# EAGLE design shock_side_control (EAGLE 9.0.1)
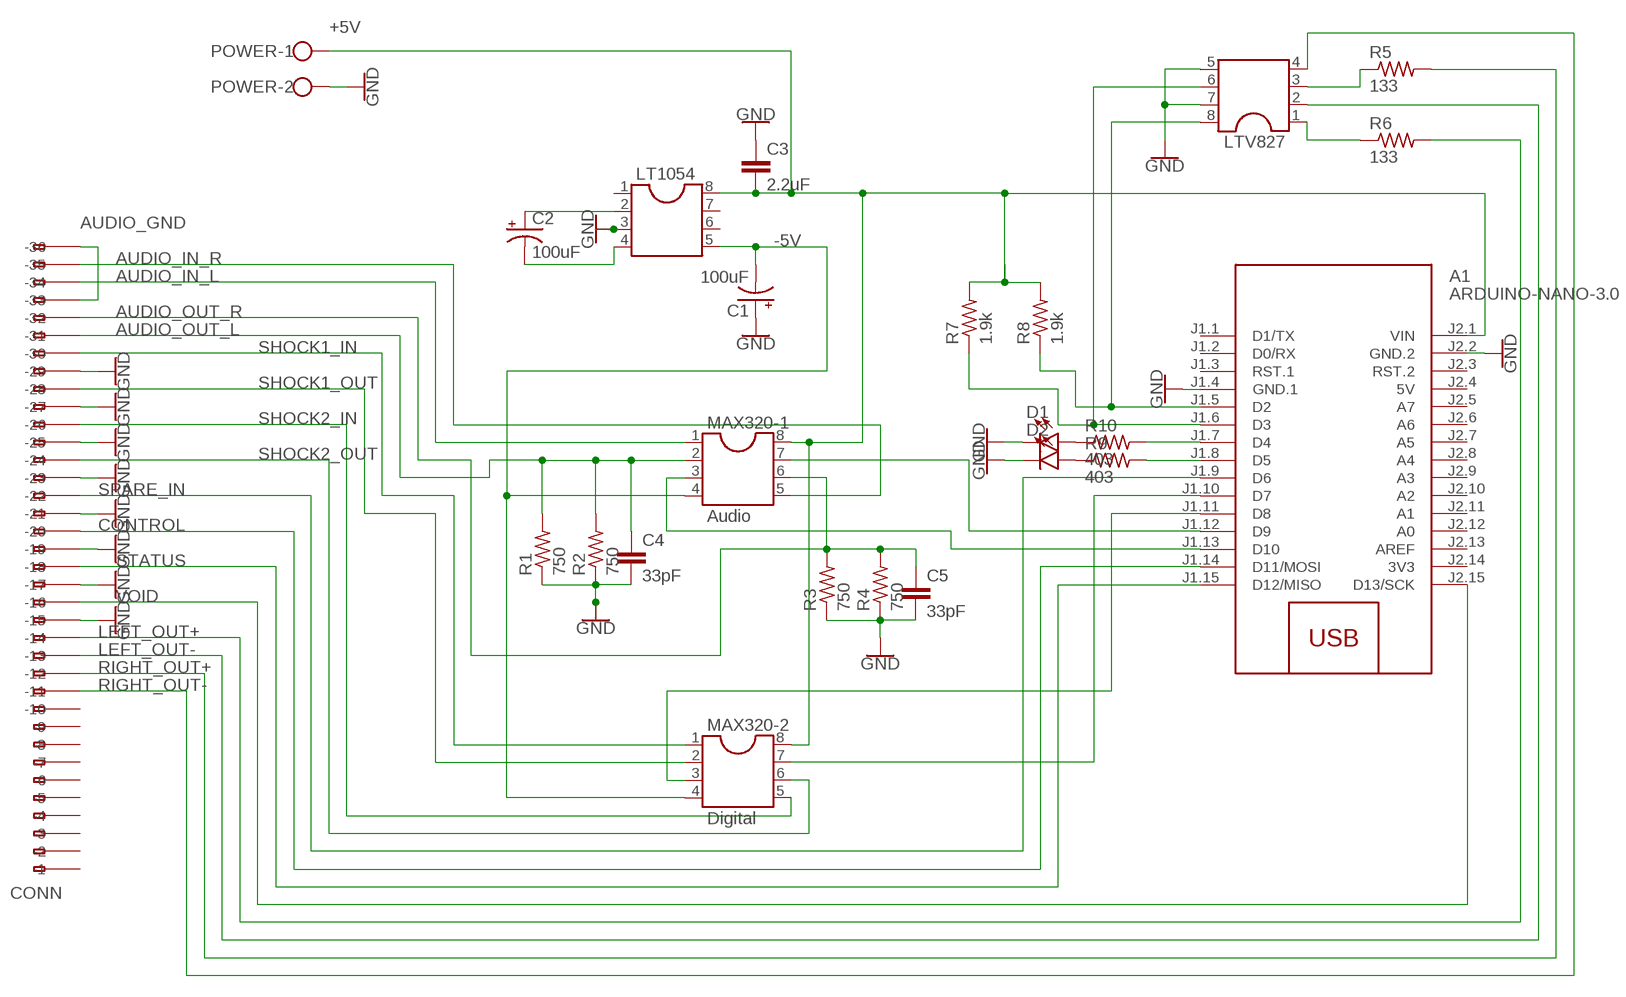
[diagram p0: schematic, sheet 1]

## Parts
A1  ARDUINO-NANO-3.0  [ARDUINO-NANO-3.0]
C1  100uF  100UF-POLAR-RADIAL-2.5MM-25V-20%  [CPOL-RADIAL-2.5MM-6.5MM]
C2  100uF  100UF-POLAR-RADIAL-2.5MM-25V-20%  [CPOL-RADIAL-2.5MM-6.5MM]
C3  2.2uF  C5/2.5  [C5B2.5]
C4  33pF  C5/2.5  [C5B2.5]
C5  33pF  C5/2.5  [C5B2.5]
CONN  233-136  [233-136]
D1  LED-3MM-NO_SILK  [LED_3MM-NS]
D2  LED-3MM-NO_SILK  [LED_3MM-NS]
LT1054  DIL8  [DIL08]
LTV827  DIL8  [DIL08]
MAX320-1  Audio  DIL8  [DIL08]
MAX320-2  Digital  DIL8  [DIL08]
POWER  W237-02P  [W237-132]
R1  750  FLIPFLOP-RES  [0805-THM]
R2  750  FLIPFLOP-RES  [0805-THM]
R3  750  FLIPFLOP-RES  [0805-THM]
R4  750  FLIPFLOP-RES  [0805-THM]
R5  133  FLIPFLOP-RES  [0805-THM]
R6  133  FLIPFLOP-RES  [0805-THM]
R7  1.9k  FLIPFLOP-RES  [0805-THM]
R8  1.9k  FLIPFLOP-RES  [0805-THM]
R9  403  FLIPFLOP-RES  [0805-THM]
R10  403  FLIPFLOP-RES  [0805-THM]

## Nets
+5V: A1.J2.1(VIN) C3.2 LT1054.8 MAX320-1.8 MAX320-2.8 POWER.1 R7.2 R8.2
-5V: C1.2(-) LT1054.5 MAX320-1.4 MAX320-2.4
AUDIO_GND: CONN.A33(-33) CONN.A36(-36)
AUDIO_IN_L: CONN.A34(-34) MAX320-1.1
AUDIO_IN_R: CONN.A35(-35) MAX320-1.5
AUDIO_OUT_L: C4.1 CONN.A31(-31) MAX320-1.2 R1.2 R2.2
AUDIO_OUT_R: C5.1 CONN.A32(-32) MAX320-1.6 R3.2 R4.2
CONTROL: A1.J1.14(D11/MOSI) CONN.A20(-20)
GND: A1.J1.4(GND.1) A1.J2.2(GND.2) C1.1(+) C3.1 C4.2 C5.2 CONN.A15(-15) CONN.A17(-17) CONN.A19(-19) CONN.A21(-21) CONN.A23(-23) CONN.A25(-25) CONN.A27(-27) CONN.A29(-29) D1.K(C) D2.K(C) LT1054.3 LTV827.5 LTV827.7 POWER.2 R1.1 R2.1 R3.1 R4.1
LEFT_OUT+: CONN.A14(-14) R6.2
LEFT_OUT-: CONN.A13(-13) LTV827.2
N$1: A1.J1.12(D9) MAX320-1.7
N$2: C2.2(-) LT1054.4
N$3: C2.1(+) LT1054.2
N$4: A1.J1.13(D10) MAX320-1.3
N$5: D2.A R9.1
N$6: D1.A R10.1
N$8: A1.J1.8(D5) R9.2
N$10: A1.J1.7(D4) R10.2
N$11: A1.J1.10(D7) MAX320-2.7
N$12: A1.J1.11(D8) MAX320-2.3
N$21: LTV827.1 R6.1
N$22: LTV827.3 R5.1
N$25: A1.J1.5(D2) LTV827.8 R8.1
N$26: A1.J1.6(D3) LTV827.6 R7.1
RIGHT_OUT+: CONN.A12(-12) R5.2
RIGHT_OUT-: CONN.A11(-11) LTV827.4
SHOCK1_IN: CONN.A30(-30) MAX320-2.1
SHOCK1_OUT: CONN.A28(-28) MAX320-2.2
SHOCK2_IN: CONN.A26(-26) MAX320-2.5
SHOCK2_OUT: CONN.A24(-24) MAX320-2.6
SPARE_IN: A1.J1.9(D6) CONN.A22(-22)
STATUS: A1.J1.15(D12/MISO) CONN.A18(-18)
VOID: A1.J2.15(D13/SCK) CONN.A16(-16)
Unconnected: A1.J1.1(D1/TX) A1.J1.2(D0/RX) A1.J1.3(RST.1) A1.J2.3(RST.2) A1.J2.5(A7) A1.J2.6(A6) A1.J2.7(A5) A1.J2.8(A4) A1.J2.9(A3) A1.J2.10(A2) A1.J2.11(A1) A1.J2.12(A0) A1.J2.13(AREF) CONN.A1(-1) CONN.A2(-2) CONN.A3(-3) CONN.A4(-4) CONN.A5(-5) CONN.A6(-6) CONN.A7(-7) CONN.A8(-8) CONN.A9(-9) CONN.A10(-10) CONN.B1(B-1) CONN.B2(B-2) CONN.B3(B-3) CONN.B4(B-4) CONN.B5(B-5) CONN.B6(B-6) CONN.B7(B-7) CONN.B8(B-8) CONN.B9(B-9) CONN.B10(B-10) CONN.B11(B-11) CONN.B12(B-12) CONN.B13(B-13) CONN.B14(B-14) CONN.B15(B-15) CONN.B16(B-16) CONN.B17(B-17) CONN.B18(B-18) CONN.B19(B-19) CONN.B20(B-20) CONN.B21(B-21) CONN.B22(B-22) CONN.B23(B-23) CONN.B24(B-24) CONN.B25(B-25) CONN.B26(B-26) CONN.B27(B-27) CONN.B28(B-28) CONN.B29(B-29) CONN.B30(B-30) CONN.B31(B-31) CONN.B32(B-32) CONN.B33(B-33) CONN.B34(B-34) CONN.B35(B-35) CONN.B36(B-36) LT1054.1 LT1054.6 LT1054.7

## Power pins joined to a net without a drawn wire
3V3: A1.J2.14(3V3)
5V: A1.J2.4(5V)

## Library data of the parts
A1 = diy-modules:ARDUINO-NANO-3.0: Arduino Nano 3.0 and compatible devices More details available here: https://www.arduino.cc/en/Main/ArduinoBoardNano Click here to find device on ebay.com <http://www.ebay.com/sch/arduino+nano>
C1 C2 = SparkFun-Capacitors:100UF-POLAR: 100µF polarized capacitors A capacitor is a passive two-terminal electrical component used to store electrical energy temporarily in an electric field.; PROD_ID: CAP-08439
C3-C5 = capacitor-wima:C: CAPACITOR naming: grid - package width
CONN = con-wago255:233-136: WAGO
D1 D2 = SparkFun-LED:LED: LED (Generic) Standard schematic elements and footprints for 5mm, 3mm, 1206, and 0603 sized LEDs. Generic LEDs with no color specified.
LT1054 LTV827 MAX320-1 MAX320-2 = ic-package:DIL8: Dual In Line / Socket
POWER = con-wago-508:W237-02P: WAGO SREW CLAMP
R1-R10 = adafruit:FLIPFLOP-RES: Flip Flop resistor An 0805 resistor inside a standard 1/4W 5% resistor. Makes for easy mods

## Board
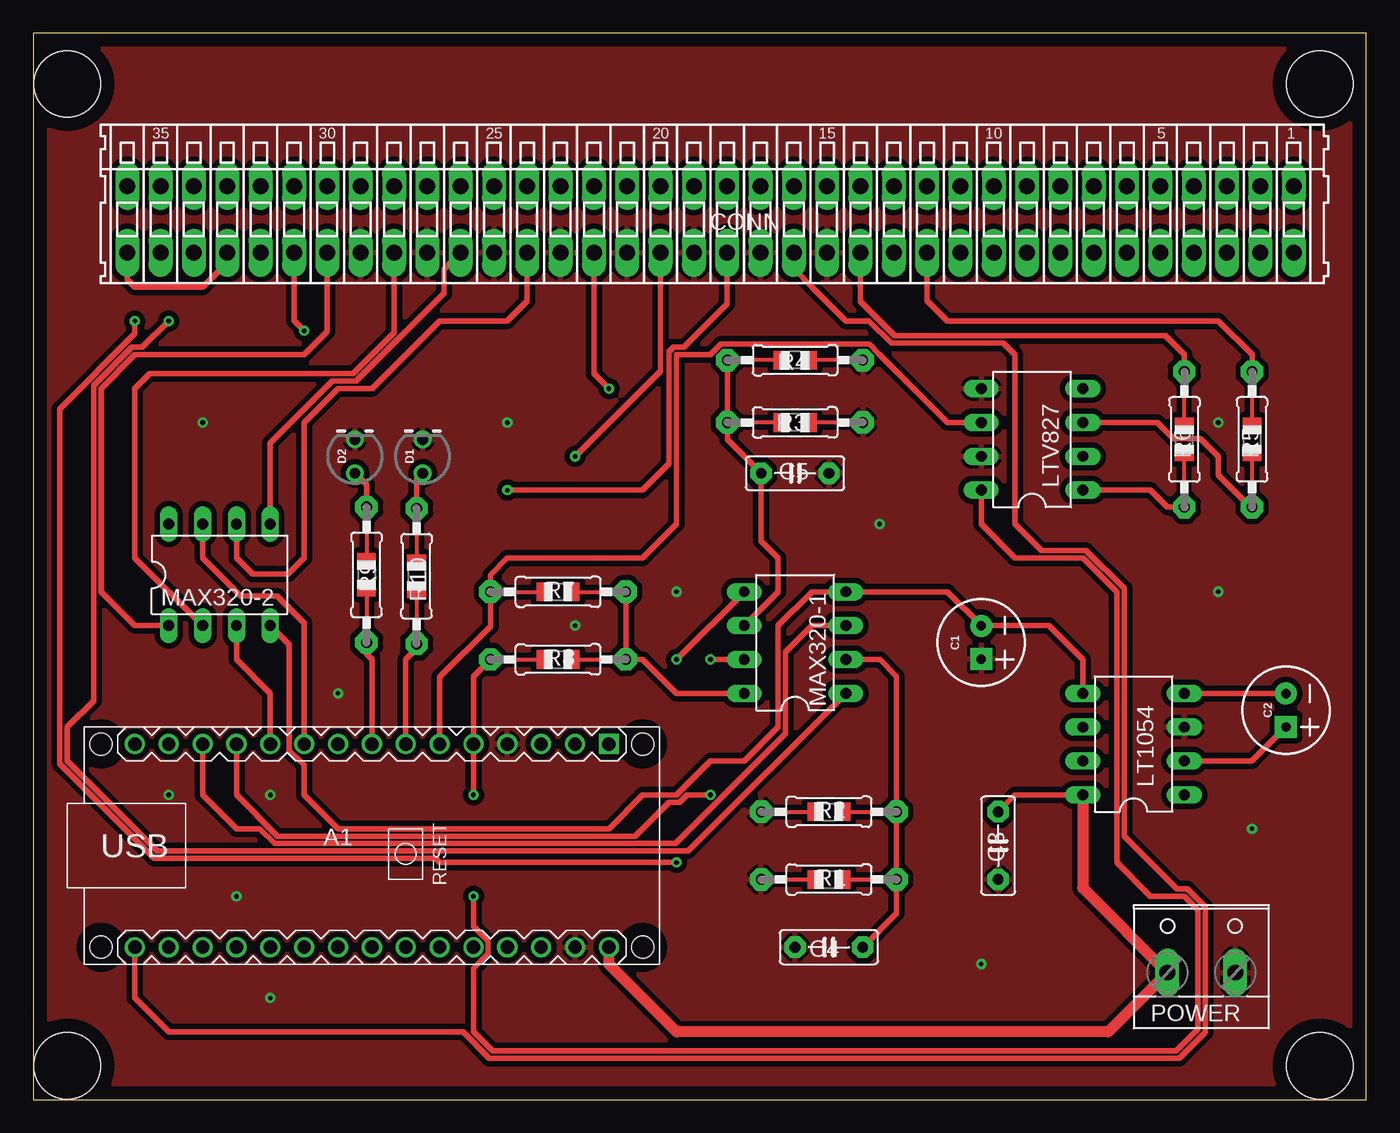
[diagram p1: board, top side]
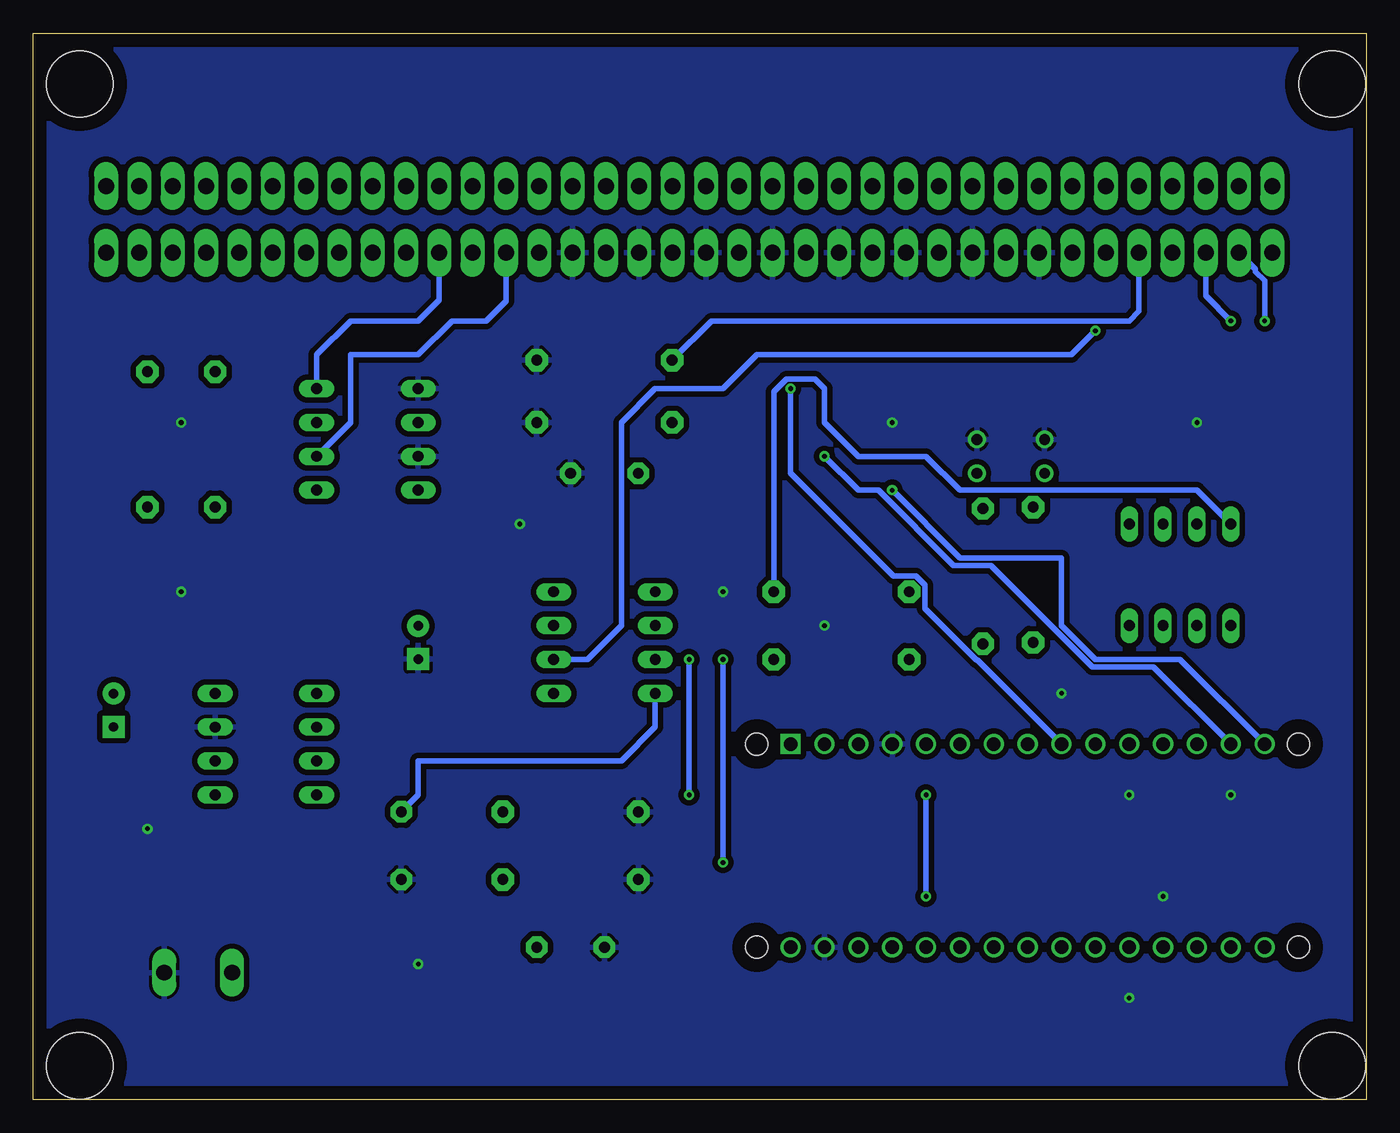
[diagram p2: board, bottom side, seen from below]

Size 100 x 80 mm. Coordinates in mm from the lower left corner, seen from the top.
Outline: 0,0 100,0 100,80 0,80 0,0
Copper layers (1*16): Top 0.035mm / dielectric 1.5mm / Bottom 0.035mm
Design rules "default": minimum track width 6mil, minimum drill 0.35mm, track to track 6mil, track to pad 6mil, pad to pad 6mil, via to via 6mil, smd to smd 6mil, copper to edge 40mil, drill to drill 6mil, minimum pad ring 10mil, minimum via ring 8mil, stop-mask expansion 4mil, vias tented up to drill 0mil, thermal gap 10mil
Holes 5 mm at 2.54,76.2 96.52,76.2 96.52,2.54 2.54,2.54

### Footprints (pad centres in the part's own frame; a part is rotated, then mirrored left to right if it is on the bottom)
ARDUINO-NANO-3.0 = drill 1 square: J1.1 17.78,7.62 | drill 1: J1.2 15.24,7.62; J1.3 12.7,7.62; J1.4 10.16,7.62; J1.5 7.62,7.62; J1.6 5.08,7.62; J1.7 2.54,7.62; J1.8 0,7.62; J1.9 -2.54,7.62; J1.10 -5.08,7.62; J1.11 -7.62,7.62; J1.12 -10.16,7.62; J1.13 -12.7,7.62; J1.14 -15.24,7.62; J1.15 -17.78,7.62; J2.1 17.78,-7.62; J2.2 15.24,-7.62; J2.3 12.7,-7.62; J2.4 10.16,-7.62; J2.5 7.62,-7.62; J2.6 5.08,-7.62; J2.7 2.54,-7.62; J2.8 0,-7.62; J2.9 -2.54,-7.62; J2.10 -5.08,-7.62; J2.11 -7.62,-7.62; J2.12 -10.16,-7.62; J2.13 -12.7,-7.62; J2.14 -15.24,-7.62; J2.15 -17.78,-7.62 | hole 1.651: -20.32,7.62; -20.32,-7.62; 20.32,-7.62; 20.32,7.62
CPOL-RADIAL-2.5MM-6.5MM = drill 0.7 pad 1.651 square: 1 1.25,0 | drill 0.7 pad 1.651: 2 -1.25,0
C5B2.5 = drill 0.813 pad 1.6 octagon: 1 -2.54,0; 2 2.54,0
233-136 = drill 1.2 long: A1 -43.75,2.5; A2 -41.25,2.5; A3 -38.75,2.5; A4 -36.25,2.5; A5 -33.75,2.5; A6 -31.25,2.5; A7 -28.75,2.5; A8 -26.25,2.5; A9 -23.75,2.5; A10 -21.25,2.5; A11 -18.75,2.5; A12 -16.25,2.5; A13 -13.75,2.5; A14 -11.25,2.5; A15 -8.75,2.5; A16 -6.25,2.5; A17 -3.75,2.5; A18 -1.25,2.5; A19 1.25,2.5; A20 3.75,2.5; A21 6.25,2.5; A22 8.75,2.5; A23 11.25,2.5; A24 13.75,2.5; A25 16.25,2.5; A26 18.75,2.5; A27 21.25,2.5; A28 23.75,2.5; A29 26.25,2.5; A30 28.75,2.5; A31 31.25,2.5; A32 33.75,2.5; A33 36.25,2.5; A34 38.75,2.5; A35 41.25,2.5; A36 43.75,2.5; B1 -43.75,-2.5; B2 -41.25,-2.5; B3 -38.75,-2.5; B4 -36.25,-2.5; B5 -33.75,-2.5; B6 -31.25,-2.5; B7 -28.75,-2.5; B8 -26.25,-2.5; B9 -23.75,-2.5; B10 -21.25,-2.5; B11 -18.75,-2.5; B12 -16.25,-2.5; B13 -13.75,-2.5; B14 -11.25,-2.5; B15 -8.75,-2.5; B16 -6.25,-2.5; B17 -3.75,-2.5; B18 -1.25,-2.5; B19 1.25,-2.5; B20 3.75,-2.5; B21 6.25,-2.5; B22 8.75,-2.5; B23 11.25,-2.5; B24 13.75,-2.5; B25 16.25,-2.5; B26 18.75,-2.5; B27 21.25,-2.5; B28 23.75,-2.5; B29 26.25,-2.5; B30 28.75,-2.5; B31 31.25,-2.5; B32 33.75,-2.5; B33 36.25,-2.5; B34 38.75,-2.5; B35 41.25,-2.5; B36 43.75,-2.5
LED_3MM-NS = drill 0.813: A -1.27,0; K 1.27,0
DIL08 = drill 0.813 long: 1 -3.81,-3.81; 2 -1.27,-3.81; 3 1.27,-3.81; 4 3.81,-3.81; 5 3.81,3.81; 6 1.27,3.81; 7 -1.27,3.81; 8 -3.81,3.81
W237-132 = drill 1.194 long: 1 -2.54,-0.635; 2 2.54,-0.635
0805-THM = drill 0.813 pad 1.676 octagon: 1 -5.08,0; 2 5.08,0

### Placement (x,y rotation side)
A1  25.4,19.05 0 top
C1  71.12,34.29 270 top
C2  93.98,29.21 270 top
C3  72.39,19.05 90 top
C4  59.69,11.43 180 top
C5  57.15,46.99 0 top
CONN  50.8,66.04 180 top
D1  29.21,48.26 90 top
D2  24.13,48.26 90 top
LT1054  82.55,26.67 90 top
LTV827  74.93,49.53 90 top
MAX320-1  57.15,34.29 90 top
MAX320-2  13.97,39.37 0 top
POWER  87.63,10.16 0 top
R1  59.69,16.51 0 top
R2  59.69,21.59 0 top
R3  57.15,50.8 180 top
R4  57.15,55.47 180 top
R5  91.44,49.53 90 top
R6  86.36,49.53 90 top
R7  39.37,38.1 0 top
R8  39.37,33.02 0 top
R9  24.99,39.37 270 top
R10  28.75,39.27 270 top

### Tracks (layer width: path | path; a pad name or v marks a point on that pad's centre or on a via)
+5V
  Top 0.406: LT1054.8 73.66,22.86 C3.2 | MAX320-1.8 48.26,30.48 45.72,33.02 R8.2 R7.2
  Top 0.813: A1.J2.1 43.18,10.16 48.26,5.08 80.64,5.08 POWER.1 78.74,15.88 LT1054.8
  Bottom 0.406: C3.2 71.12,22.86 71.12,25.4 55.88,25.4 53.34,27.94 MAX320-1.8 | MAX320-2.8 12.7,45.72 30.48,45.72 33.02,48.26 38.1,48.26 40.64,50.8 40.64,53.34 41.37,54.07 43.48,54.07 44.45,53.11 R7.2
-5V
  Top 0.152: C1.2 71.12,35.56
  Top 0.406: LT1054.5 78.74,33.02 76.2,35.56 71.12,35.56 68.58,38.1 MAX320-1.4 58.42,38.1 55.88,35.56 55.88,27.94 53.34,25.4 50.8,25.4 48.26,22.86 45.72,22.86 43.18,20.32 22.86,20.32 20.32,22.86 20.32,25.1 19.21,26.21 19.21,34.13 MAX320-2.4
AUDIO_GND
  Top 0.406: CONN.A36 7.05,61.53 7.62,60.96 12.7,60.96 14.55,62.81 CONN.A33
AUDIO_IN_L  (via drill 0.35)
  Top 0.406: v10.16,58.42 8.18,56.44 7.39,56.44 4.52,53.57 4.52,29.92 2.54,27.94 2.54,25.4 9.3,18.64 49.12,18.64 MAX320-1.1
  Bottom 0.406: CONN.A34 12.05,60.31 v10.16,58.42
AUDIO_IN_R  (via drill 0.35)
  Top 0.406: v7.62,58.42 7.62,57.46 1.98,51.82 1.98,25.17 9.06,18.09 30.18,18.09 30.48,17.78 v48.26,17.78 | v48.26,33.02 MAX320-1.5
  Bottom 0.406: CONN.A35 8.31,62.3 8.31,62.12 7.62,61.43 v7.62,58.42 | v48.26,17.78 v48.26,33.02
AUDIO_OUT_L  (via drill 0.35)
  Top 0.406: C4.1 64.77,13.97 R1.2 R2.2 64.77,31.75 63.5,33.02 MAX320-1.2 | CONN.A31 19.55,58.46 v20.32,57.69
  Bottom 0.406: v20.32,57.69 22.13,55.88 45.72,55.88 48.26,53.34 53.34,53.34 55.88,50.8 55.88,35.56 58.42,33.02 MAX320-1.2
AUDIO_OUT_R
  Top 0.406: R4.2 R3.2 52.07,49.53 C5.1 54.61,41.91 55.88,40.64 55.88,38.1 MAX320-1.6
  Bottom 0.406: CONN.A32 17.05,59.15 17.78,58.42 49.12,58.42 R4.2
CONTROL  (via drill 0.35)
  Top 0.406: v40.64,48.26 47.05,54.67 CONN.A20
  Bottom 0.406: A1.J1.14 15.95,32.46 20.55,32.46 28.17,40.08 30.96,40.08 36.6,45.72 38.1,45.72 v40.64,48.26
GND  (via drill 0.35)
  other vias: 12.7,50.8 35.56,50.8 63.5,43.18 88.9,38.1 91.44,20.32 71.12,10.16 15.24,15.24 48.26,38.1 10.16,22.86 17.78,7.62 88.9,50.8 40.64,35.56 17.78,22.86 22.86,30.48
  pour Bottom (isolate 0.406): 0,79.96 0,0 99.87,0 99.87,79.96
  pour Top (isolate 0.406): 0,0 0,79.55 100.28,79.96 100.28,0.41
LEFT_OUT+
  Top 0.406: R6.2 86.36,55.88 84.94,57.3 64.62,57.3 62.05,59.87 CONN.A14
LEFT_OUT-
  Bottom 0.406: LTV827.2 76.2,50.8 76.2,55.88 71.12,55.88 68.58,58.42 66.04,58.42 64.55,59.91 CONN.A13
N$1  (via drill 0.35)
  Top 0.406: MAX320-1.7 v50.8,33.02 | v50.8,22.86 49.05,22.86 48.49,22.3 47.7,22.3 45.16,19.76 18.34,19.76 15.24,22.86 A1.J1.12
  Bottom 0.406: v50.8,33.02 v50.8,22.86
N$2
  Top 0.406: LT1054.4 93.96,30.48 C2.2
N$3
  Top 0.406: LT1054.2 91.42,25.4 C2.1
N$4
  Top 0.406: MAX320-1.3 58.42,35.56 56.44,33.58 56.44,27.46 48.18,19.2 18.11,19.2 16.99,20.32 15.24,20.32 12.7,22.86 A1.J1.13
N$5
  Top 0.406: R9.1 24.99,46.13 D2.A
N$6
  Top 0.406: R10.1 28.75,46.53 D1.A
N$8
  Top 0.406: R9.2 24.99,33.43 25.4,33.02 A1.J1.8
N$10
  Top 0.406: R10.2 28.75,33.83 27.94,33.02 A1.J1.7
N$11
  Top 0.406: A1.J1.10 20.32,35.76 18.29,37.8 15.54,37.8 12.7,40.64 MAX320-2.7
N$12
  Top 0.406: A1.J1.11 17.78,30.48 15.24,33.02 MAX320-2.3
N$21
  Top 0.406: R6.1 85.09,44.45 83.82,45.72 LTV827.1
N$22
  Top 0.406: R5.1 91.37,44.52 91.23,44.52 88.9,46.85 88.9,48.26 87.56,49.6 85.51,49.6 84.31,50.8 LTV827.3
N$25  (via drill 0.35)
  Top 0.406: R8.1 33.02,31.75 A1.J1.5 v33.02,22.86 | LTV827.8 71.12,43.18 73.66,40.64 78.74,40.64 81.28,38.1 81.28,17.78 83.82,15.24 86.36,15.24 87.38,14.22 87.38,5.28 85.75,3.66 34.44,3.66 33.02,5.08 33.02,9.86 34.13,10.97 34.13,11.89 33.02,13 v33.02,15.24
  Bottom 0.406: v33.02,22.86 v33.02,15.24
N$26
  Top 0.406: A1.J1.6 30.48,31.7 34.29,35.51 R7.1 34.29,39.37 35.56,40.64 45.72,40.64 48.26,43.18 48.26,55.88 50.79,55.88 51.58,56.67 62.72,56.67 63.42,55.97 63.42,55.96 68.58,50.8 LTV827.6
RIGHT_OUT+
  Top 0.406: R5.2 91.44,55.88 88.9,58.42 71.12,58.42 68.58,58.42 67.05,59.95 CONN.A12
RIGHT_OUT-
  Bottom 0.406: LTV827.4 78.74,55.88 76.2,58.42 71.12,58.42 69.55,59.99 CONN.A11
SHOCK1_IN
  Top 0.406: MAX320-2.1 7.62,35.56 5.08,38.1 5.08,53.34 7.62,55.88 20.32,55.88 22.05,57.61 CONN.A30
SHOCK1_OUT
  Top 0.406: CONN.A28 27.05,57.53 23.98,54.46 8.74,54.46 7.62,53.34 7.62,40.64 MAX320-2.2
SHOCK2_IN
  Top 0.406: MAX320-2.5 17.78,49.27 22.41,53.9 24.21,53.9 30.81,60.49 30.81,62.3 CONN.A26
SHOCK2_OUT
  Top 0.406: CONN.A24 37.05,59.91 35.56,58.42 30.48,58.42 25.4,53.34 22.86,53.34 20.32,50.8 20.32,40.64 19.1,39.42 18.29,39.42 17.78,39.42 16.46,39.42 15.24,40.64 MAX320-2.6
SPARE_IN  (via drill 0.35)
  Top 0.406: v43.18,53.34 42.05,54.47 CONN.A22
  Bottom 0.406: v43.18,53.34 43.18,46.99 35.48,39.29 33.8,39.29 33.1,38.59 33.1,36.84 29.25,32.99 29.18,32.99 A1.J1.9
STATUS  (via drill 0.35)
  Top 0.406: v35.56,45.72 45.72,45.72 47.7,47.7 47.7,56.11 48.03,56.44 48.82,56.44 52.05,59.67 CONN.A18
  Bottom 0.406: A1.J1.15 13.97,33.02 20.32,33.02 22.86,35.56 22.86,40.64 30.48,40.64 v35.56,45.72
VOID
  Top 0.406: CONN.A16 57.05,62.33 58.42,60.96 60.96,58.42 62.71,58.42 64.39,56.74 72.8,56.74 73.66,55.88 73.66,43.18 75.64,41.2 78.97,41.2 81.84,38.33 81.84,19.76 85.8,15.8 86.59,15.8 87.94,14.46 87.94,5.05 85.98,3.1 34.21,3.1 32.23,5.08 10.16,5.08 7.62,7.62 A1.J2.15

### Text on the board
tValues: AI- | AIR | AIL | AO- | AOR | AOL | S1I | GND | S1O | GND | S2I | GND | S2O | GND | SPI | GND | CTL | GND | ST | GND | VOD | GND | LO+ | LO- | RO+ | RO- | Shock Side Control | by Christian Henning | + | -